# Altium schematic sheet NOX_V3.SchDoc
size 896 x 424 mm
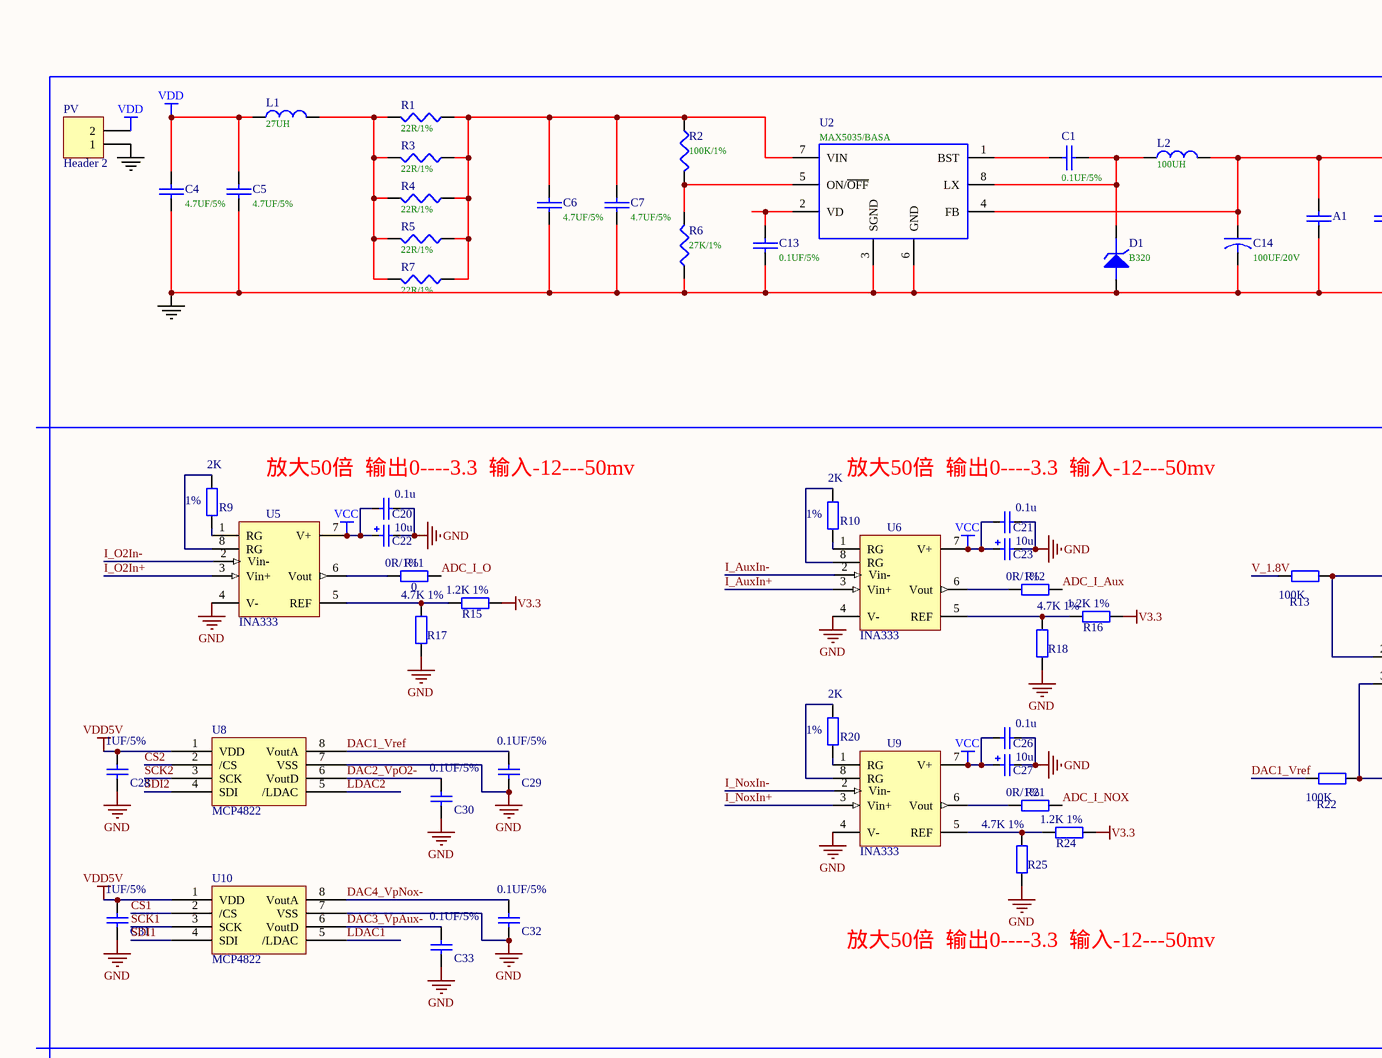
[diagram p0: NOX_V3.SchDoc, top left]
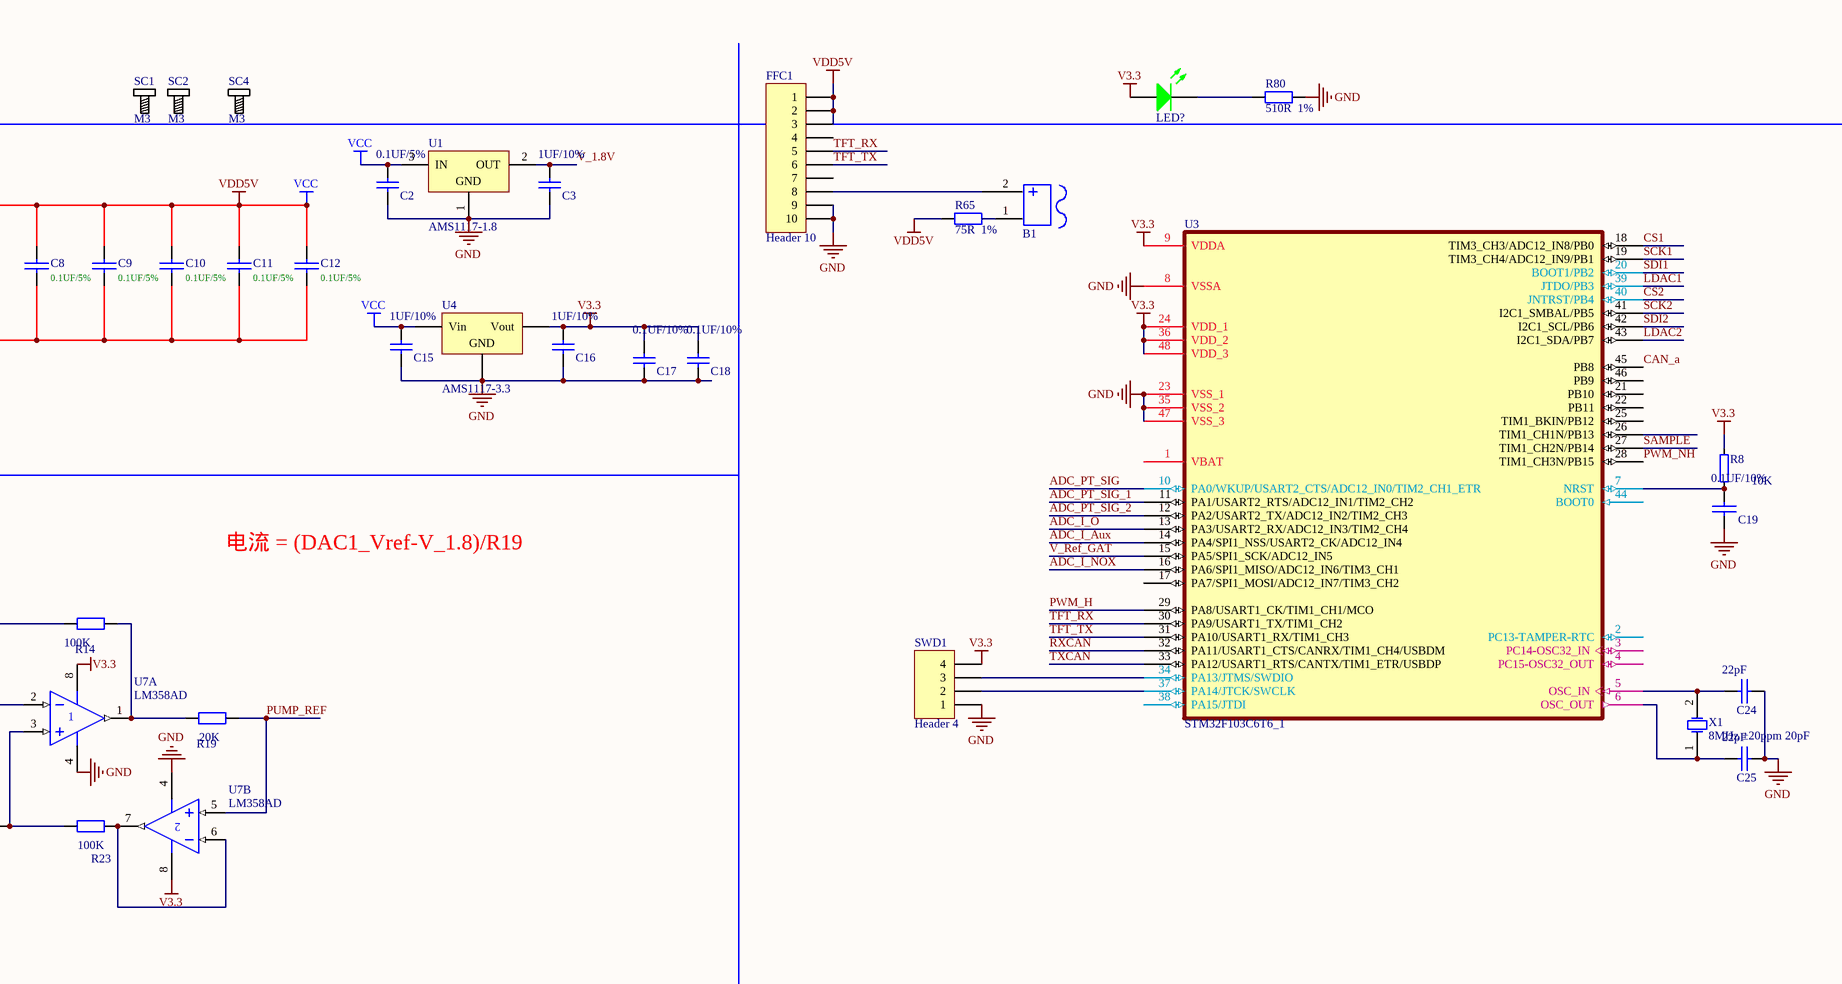
[diagram p1: NOX_V3.SchDoc, top middle]
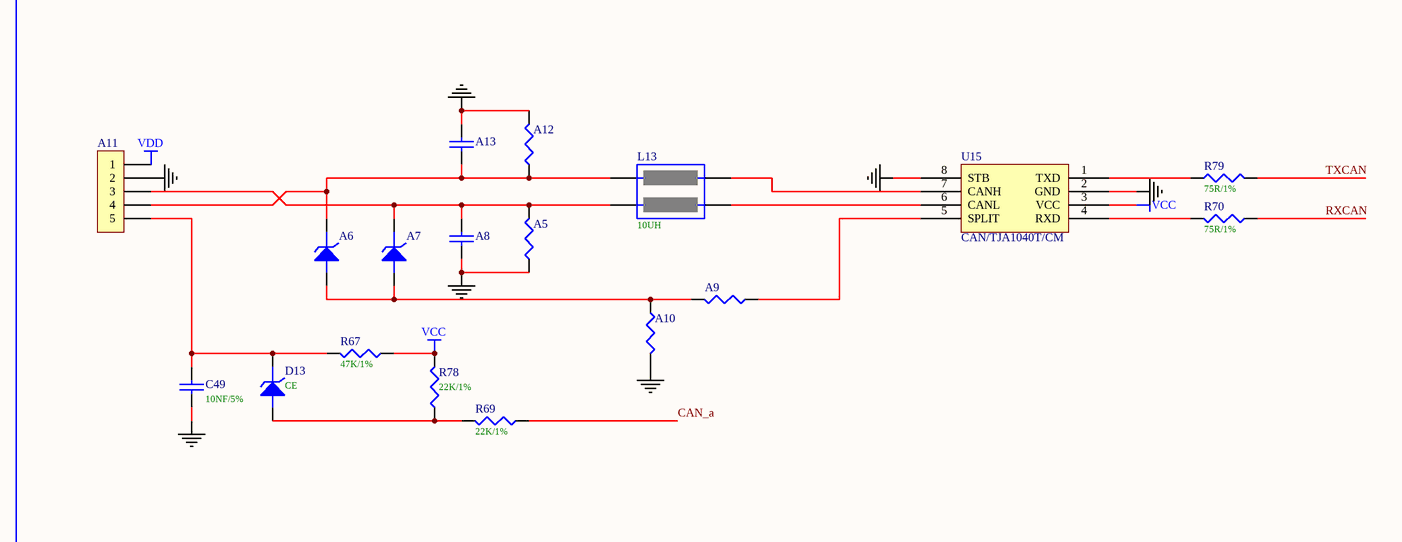
[diagram p2: NOX_V3.SchDoc, top right]
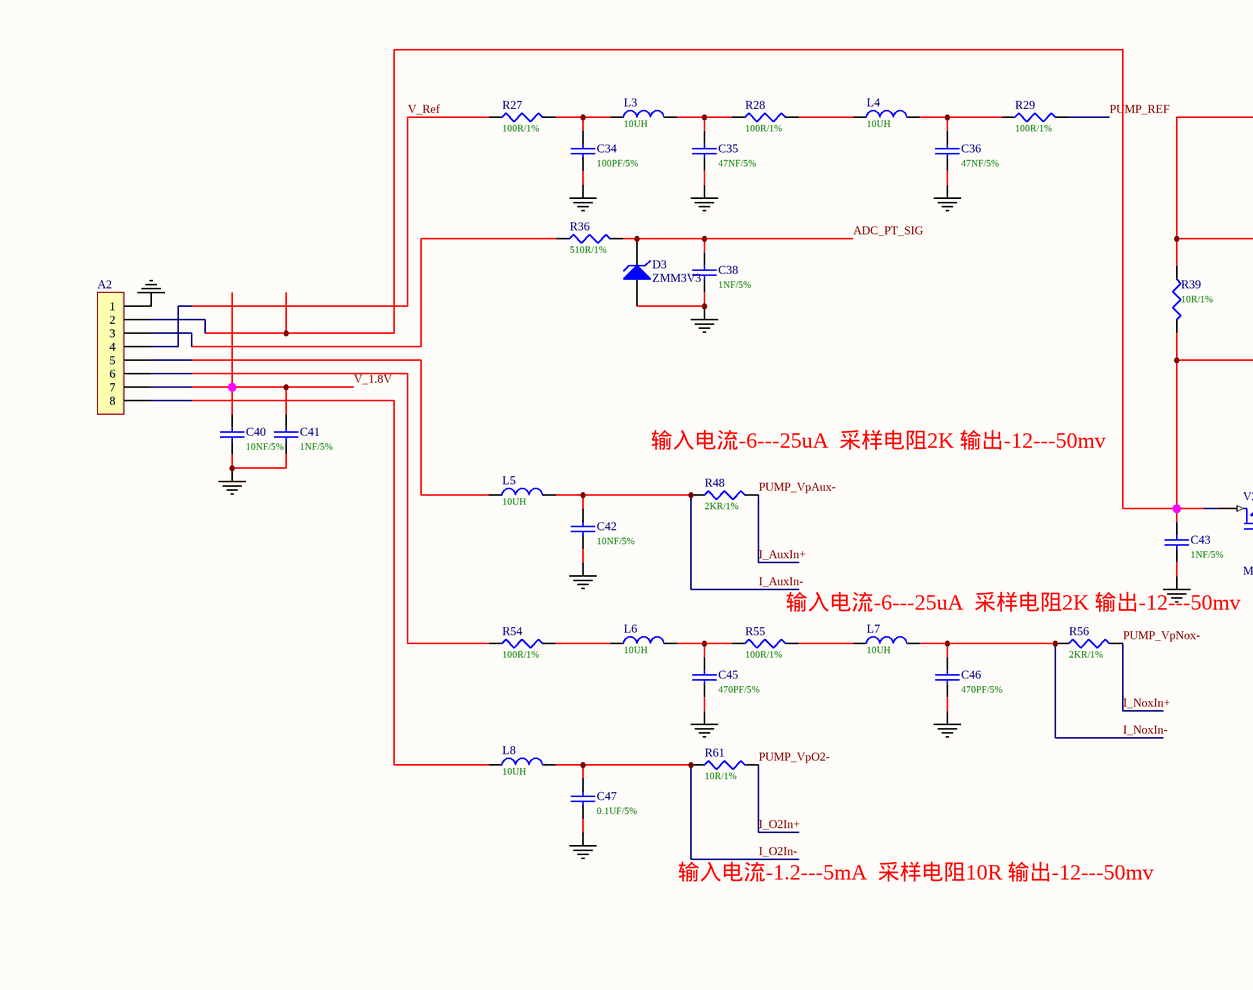
[diagram p3: NOX_V3.SchDoc, bottom left]
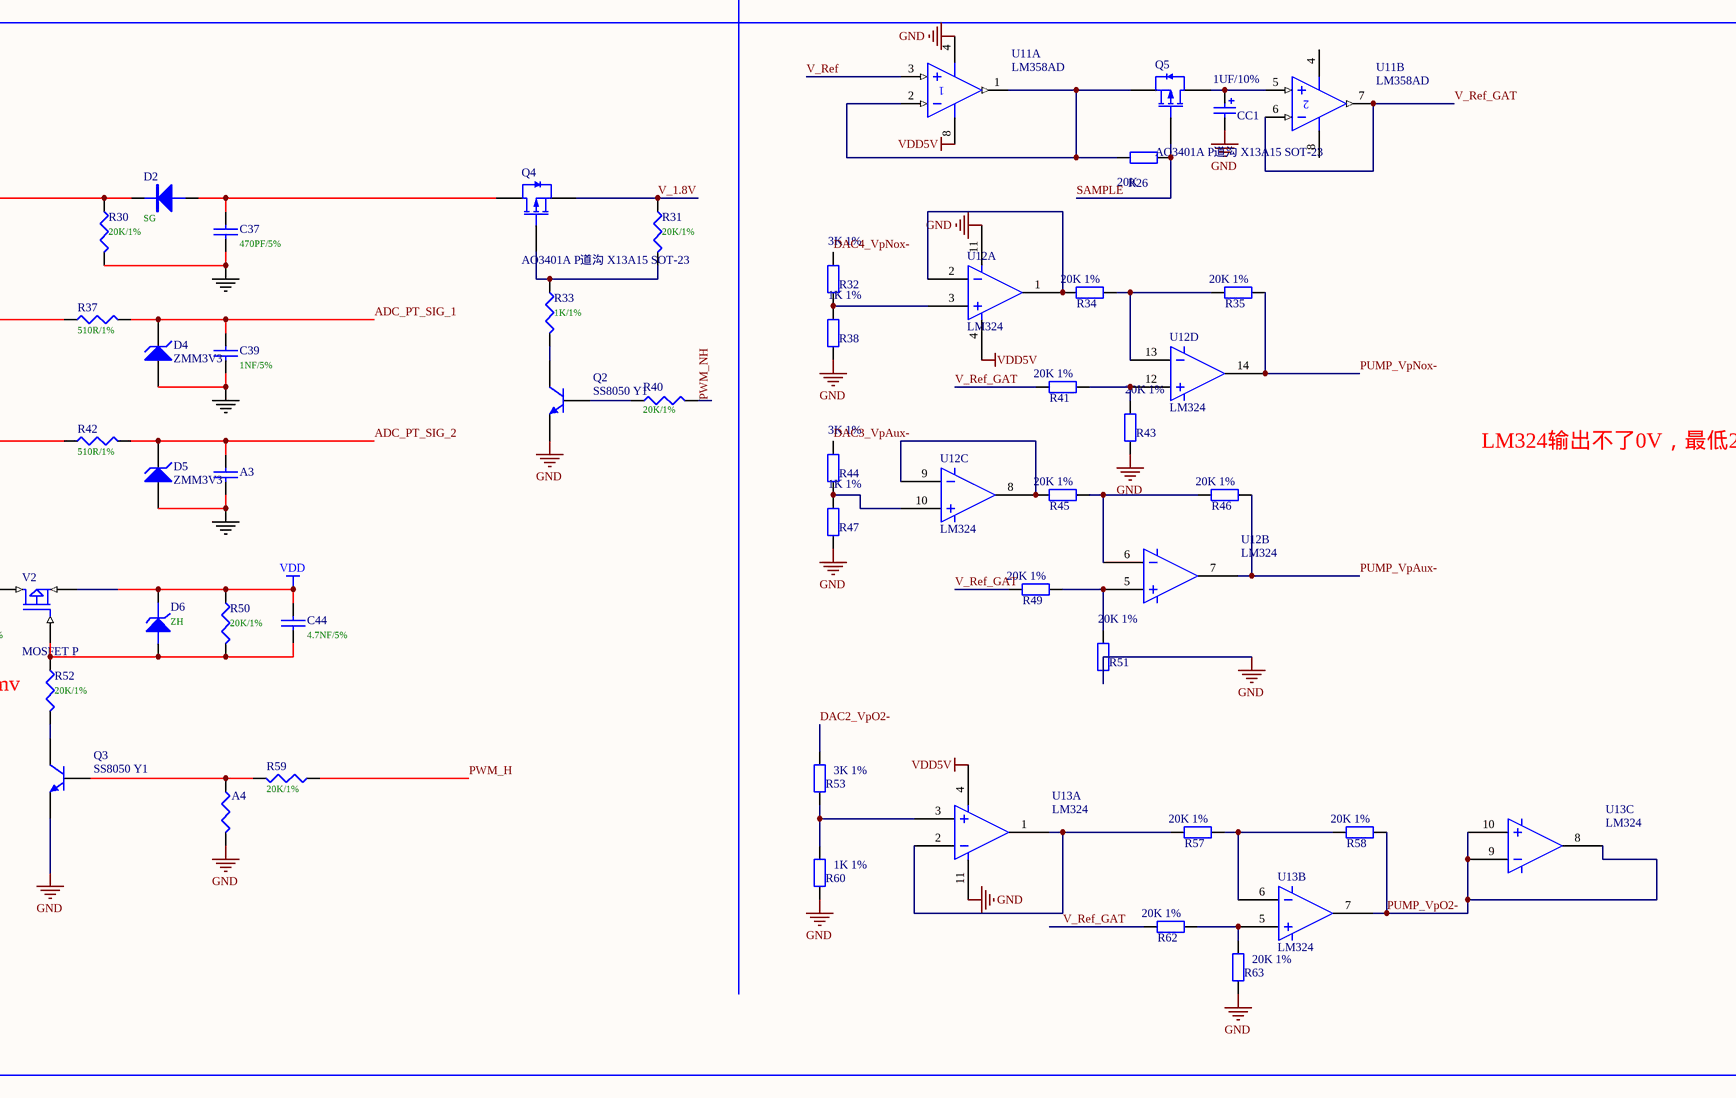
[diagram p4: NOX_V3.SchDoc, bottom middle]

## Parts
A1  (no value)  [1206]
A2  (no value)  [HX3.96-8]
A3  (no value)  [1608[0603]]
A4  (no value)  [1608[0603]]
A5  (no value)  [0603]
A6  (no value)  [1206]
A7  (no value)  [1206]
A8  (no value)  [0603_C]
A9  (no value)  [0603]
A10  (no value)  [0603]
A11  (no value)  [HX3.96-5]
A12  (no value)  [0603]
A13  (no value)  [0603_C]
B1  Buzzer  [BUZZER]  (value not drawn)
C1  0.1UF/5%  [0603_C]
C2  0.1UF/5%  [0603_C]
C3  1UF/10%  [0603_C]
C4  4.7UF/5%  [1210]
C5  4.7UF/5%  [1210]
C6  4.7UF/5%  [1210]
C7  4.7UF/5%  [1210]
C8  0.1UF/5%  [0603_C]
C9  0.1UF/5%  [0603_C]
C10  0.1UF/5%  [0603_C]
C11  0.1UF/5%  [0603_C]
C12  0.1UF/5%  [0603_C]
C13  0.1UF/5%  [0603_C]
C14  100UF/20V  [CAP_ELEC_6.3x4.2]
C15  1UF/10%  [0603_C]
C16  1UF/10%  [0603_C]
C17  0.1UF/10%  [0603_C]
C18  0.1UF/10%  [0603_C]
C19  0.1UF/10%  [0603_C]
C20  0.1u  [0603_C]
C21  0.1u  [0603_C]
C22  10u  [0805_C]
C23  10u  [0805_C]
C24  22pF  [0603_C]
C25  22pF  [0603_C]
C26  0.1u  [0603_C]
C27  10u  [0805_C]
C28  1UF/5%  [0603_C]
C29  0.1UF/5%  [0603_C]
C30  0.1UF/5%  [0603_C]
C31  1UF/5%  [0603_C]
C32  0.1UF/5%  [0603_C]
C33  0.1UF/5%  [0603_C]
C34  100PF/5%  [0603_C]
C35  47NF/5%  [0603_C]
C36  47NF/5%  [0603_C]
C37  470PF/5%  [0603_C]
C38  1NF/5%  [0603_C]
C39  1NF/5%  [0603_C]
C40  10NF/5%  [0603_C]
C41  1NF/5%  [0805_C]
C42  10NF/5%  [0603_C]
C43  1NF/5%  [0603_C]
C44  4.7NF/5%  [0603_C]
C45  470PF/5%  [0603_C]
C46  470PF/5%  [0603_C]
C47  0.1UF/5%  [0603_C]
C49  10NF/5%  [0603_C]
CC1  1UF/10%  [TAN-A-3216]
D1  B320  [SMB]
D2  SG  [SMA]
D3  ZMM3V3  [LL-34]
D4  ZMM3V3  [LL-34]
D5  ZMM3V3  [LL-34]
D6  ZH  [SOD123]
D13  CE  [SOD123]
FFC1  Header 10  [FCC1.0-10]
L1  27UH  [SLF7032]
L2  100UH  [SLF7032]
L3  10UH  [0603_L]
L4  10UH  [0603_L]
L5  10UH  [0603_L]
L6  10UH  [0603_L]
L7  10UH  [0603_L]
L8  10UH  [0603_L]
L13  10UH  [1812-4]
LED?  LED-3-G  [LED-R3-H5-SINGLE-G]  (value not drawn)
PV  Header 2  [HX5.08-2L]
Q2  SS8050 Y1  [SOT-23(SOT-23-3)]
Q3  SS8050 Y1  [SOT-23(SOT-23-3)]
Q4  AO3401A P道沟 X13A15 SOT-23  [SOT-23-3L]
Q5  AO3401A P道沟 X13A15 SOT-23  [SOT-23-3L]
R1  22R/1%  [1206_R]
R2  100K/1%  [0603_R]
R3  22R/1%  [1206_R]
R4  22R/1%  [1206_R]
R5  22R/1%  [1206_R]
R6  27K/1%  [0603_R]
R7  22R/1%  [1206_R]
R8  10K  [0603_R]
R9  2K  精度: 1%  [0603_R]
R10  2K  精度: 1%  [0603_R]
R11  0R/1%  value 0  [0603_R]
R12  0R/1%  [0603_R]
R13  100K  [0603_R]
R14  100K  [0603_R]
R15  1.2K 1%  [0603_R]
R16  1.2K 1%  [0603_R]
R17  4.7K 1%  [0603_R]
R18  4.7K 1%  [0603_R]
R19  20K  [0603_R]
R20  2K  精度: 1%  [0603_R]
R21  0R/1%  [0603_R]
R22  100K  [0603_R]
R23  100K  [0603_R]
R24  1.2K 1%  [0603_R]
R25  4.7K 1%  [0603_R]
R26  20K  [0603_R]
R27  100R/1%  [0603_R]
R28  100R/1%  [0603_R]
R29  100R/1%  [0603_R]
R30  20K/1%  [0603_R]
R31  20K/1%  [0603_R]
R32  3K 1%  [0603_R]
R33  1K/1%  [0603_R]
R34  20K 1%  [0603_R]
R35  20K 1%  [0603_R]
R36  510R/1%  [0805_R]
R37  510R/1%  [0805_R]
R38  1K 1%  [0603_R]
R39  10R/1%  [1206_R]
R40  20K/1%  [0603_R]
R41  20K 1%  [0603_R]
R42  510R/1%  [0805_R]
R43  20K 1%  [0603_R]
R44  3K 1%  [0603_R]
R45  20K 1%  [0603_R]
R46  20K 1%  [0603_R]
R47  1K 1%  [0603_R]
R48  2KR/1%  [0603_R]
R49  20K 1%  [0603_R]
R50  20K/1%  [0603_R]
R51  20K 1%  [0603_R]
R52  20K/1%  [0603_R]
R53  3K 1%  [0603_R]
R54  100R/1%  [0603_R]
R55  100R/1%  [0603_R]
R56  2KR/1%  [0603_R]
R57  20K 1%  [0603_R]
R58  20K 1%  [0603_R]
R59  20K/1%  [0603_R]
R60  1K 1%  [0603_R]
R61  10R/1%  [0603_R]
R62  20K 1%  [0603_R]
R63  20K 1%  [0603_R]
R65  75R  1%  [0603_R]
R67  47K/1%  [0603_R]
R69  22K/1%  [0603_R]
R70  75R/1%  [0603_R]
R78  22K/1%  [0603_R]
R79  75R/1%  [0603_R]
R80  510R  1%  [0603_R]
SC1  M3  [SCRREW_M3]
SC2  M3  [SCRREW_M3]
SC4  M3  [SCRREW_M3]
SWD1  Header 4  [HDR1X4]
U1  AMS1117-1.8  [SOT-223]
U2  MAX5035/BASA  [SO8]
U3  STM32F103C6T6_1  [LQFP-48]
U4  AMS1117-3.3  [SOT-223]
U5  INA333  [TSSOP_8]
U6  INA333  [TSSOP_8]
U7  LM358AD  [SOP-8M]  (parts A,B of 2)
U8  MCP4822  [SO8_M]
U9  INA333  [TSSOP_8]
U10  MCP4822  [SO8_M]
U11  LM358AD  [SOP-8M]  (parts A,B of 2)
U12  LM324  [SOP-14M]  (parts A,B,C,D of 4)
U13  LM324  [SOP-14M]  (parts A,B,C of 4)
U15  CAN/TJA1040T/CM  [SOIC-8_150mil]
V2  MOSFET P  [TO-252]
X1  8MHz ±20ppm 20pF  [SMD-5032_2P]

## Nets
GND: A1.1 A2.1 A3.1 A4.1 A5.1 A8.1 A10.2 A11.2 A12.1 A13.1 C2.1 C3.1 C4.2 C5.2 C6.2 C7.2 C8.1 C9.1 C10.1 C11.2 C12.2 C13.2 C14.2 C15.1 C16.1 C17.1 C18.1 C19.1 C20.1 C21.1 C22.2 C23.2 C24.2 C25.2 C26.1 C27.2 C28.1 C29.1 C30.1 C31.1 C32.1 C33.1 C34.1 C35.1 C36.1 C37.1 C38.2 C39.2 C40.1 C41.1 C42.1 C43.1 C45.2 C46.1 C47.1 C49.2 CC1.1 D1.1(A) D3.1(A) D4.1(A) D5.1(A) FFC1.9 FFC1.10 PV.1 Q2.2(E) Q3.2(E) R6.1 R17.1 R18.1 R25.1 R30.1 R38.1 R43.1 R47.1 R51.1 R60.1 R63.1 R80.2 SWD1.1 U1.1(GND) U2.3(SGND) U2.6(GND) U3.8(VSSA) U3.23(VSS_1) U3.35(VSS_2) U3.47(VSS_3) U4.1(GND) U5.4(V-) U6.4(V-) U7.4(V-) U8.7(VSS) U9.4(V-) U10.7(VSS) U11.4(V-) U12.11 U13.11 U15.2(GND) U15.8(STB)
V3.3: C16.2 C17.2 C18.2 LED?.1(A) R8.2 R15.1 R16.1 R24.1 SWD1.4 U3.9(VDDA) U3.24(VDD_1) U3.36(VDD_2) U3.48(VDD_3) U4.2(Vout) U7.8(V+)
VCC: A1.2 C2.2 C8.2 C9.2 C10.2 C11.1 C12.1 C14.1 C15.2 C20.2 C21.2 C22.1 C23.1 C26.2 C27.1 C28.2 C31.2 FFC1.1 FFC1.2 FFC1.3 L2.1 R65.1 R67.1 R78.2 U1.3(IN) U2.4(FB) U4.3(Vin) U5.7(V+) U6.7(V+) U8.1(VDD) U9.7(V+) U10.1(VDD) U11.8(V+) U12.4 U13.4 U15.3(VCC)  [also labelled VDD5V]
VDD: A11.1 C4.1 C5.1 C44.1 D6.2(K) L1.2 PV.2 R50.2 V2.3(S)
ADC_I_Aux: R12.1 U3.14(PA4/SPI1_NSS/USART2_CK/ADC12_IN4)
ADC_I_NOX: R21.1 U3.16(PA6/SPI1_MISO/ADC12_IN6/TIM3_CH1)
ADC_I_O: R11.1 U3.13(PA3/USART2_RX/ADC12_IN3/TIM2_CH4)
ADC_PT_SIG: C38.1 D3.2(K) R36.1 U3.10(PA0/WKUP/USART2_CTS/ADC12_IN0/TIM2_CH1_ETR)
ADC_PT_SIG_1: C39.1 D4.2(K) R37.2 U3.11(PA1/USART2_RTS/ADC12_IN1/TIM2_CH2)
ADC_PT_SIG_2: A3.2 D5.2(K) R42.1 U3.12(PA2/USART2_TX/ADC12_IN2/TIM2_CH3)
CAN_a: R69.1 U3.45(PB8)
CS1: U3.18(TIM3_CH3/ADC12_IN8/PB0) U10.2(/CS)
CS2: U3.40(JNTRST/PB4) U8.2(/CS)
DAC1_Vref: C29.2 R22.1 U8.8(VoutA)
DAC2_VpO2-: C30.2 R53.2 U8.6(VoutD)
DAC3_VpAux-: C33.2 R44.2 U10.6(VoutD)
DAC4_VpNox-: C32.2 R32.2 U10.8(VoutA)
I_AuxIn+: R46.1 R48.2 U6.3(Vin+) U12.7  [also labelled PUMP_VpAux-]
I_AuxIn-: C42.2 L5.1 R48.1 U6.2(Vin-)
I_NoxIn+: R35.1 R56.2 U9.3(Vin+) U12.14  [also labelled PUMP_VpNox-]
I_NoxIn-: C46.2 L7.1 R56.1 U9.2(Vin-)
I_O2In+: R58.1 R61.2 U5.3(Vin+) U13.7 U13.8 U13.9 U13.10  [also labelled PUMP_VpO2-]
I_O2In-: C47.2 L8.2 R61.1 U5.2(Vin-)
LDAC1: U3.39(JTDO/PB3) U10.5(/LDAC)
LDAC2: U3.43(I2C1_SDA/PB7) U8.5(/LDAC)
PUMP_REF: R19.2 R29.2 U7.5(IN+)
PWM_H: R59.1 U3.29(PA8/USART1_CK/TIM1_CH1/MCO)
PWM_NH: R40.1 U3.28(TIM1_CH3N/PB15)
RXCAN: R70.2 U3.32(PA11/USART1_CTS/CANRX/TIM1_CH4/USBDM)
SAMPLE: Q5.1(G) R26.2 U3.27(TIM1_CH2N/PB14)
SCK1: U3.19(TIM3_CH4/ADC12_IN9/PB1) U10.3(SCK)
SCK2: U3.41(I2C1_SMBAL/PB5) U8.3(SCK)
SDI1: U3.20(BOOT1/PB2) U10.4(SDI)
SDI2: U3.42(I2C1_SCL/PB6) U8.4(SDI)
TFT_RX: FFC1.5 U3.30(PA9/USART1_TX/TIM1_CH2)
TFT_TX: FFC1.6 U3.31(PA10/USART1_RX/TIM1_CH3)
TXCAN: R79.1 U3.33(PA12/USART1_RTS/CANTX/TIM1_ETR/USBDP)
V_1.8V: A2.7 C3.2 C40.2 C41.2 Q4.2(S) R13.1 R31.2 U1.2(OUT)
V_Ref: A2.4 R27.2 U11.3(IN+)
V_Ref_GAT: R41.2 R49.2 R62.2 U3.15(PA5/SPI1_SCK/ADC12_IN5) U11.6(IN-) U11.7(OUT)
NetA2_2: A2.2 C43.2 R39.1 R42.2 V2.2(D)
NetA2_3: A2.3 R36.2
NetA2_5: A2.5 L5.2
NetA2_6: A2.6 R54.1
NetA2_8: A2.8 L8.1
NetA4_2: A4.2 Q3.1(B) R59.2
NetA5_2: A5.2 A7.2(K) A8.2 A11.3 L13.4
NetA6_1: A6.1(A) A7.1(A) A9.1 A10.1
NetA6_2: A6.2(K) A11.4 A12.2 A13.2 L13.3
NetA9_2: A9.2 U15.5(SPLIT)
NetA11_5: A11.5 C49.1 D13.2(K) R67.2
NetB1_1: B1.1 R65.2
NetB1_2: B1.2 FFC1.8
NetC1_1: C1.1 D1.2(K) L2.2 U2.8(LX)
NetC1_2: C1.2 U2.1(BST)
NetC6_1: C6.1 C7.1 R1.1 R2.1 R3.1 R4.1 R5.2 R7.2 U2.7(VIN)
NetC13_1: C13.1 U2.2(VD)
NetC19_2: C19.2 R8.1 U3.7(NRST)
NetC24_1: C24.1 U3.5(OSC_IN) X1.2(OSC2)
NetC25_1: C25.1 U3.6(OSC_OUT) X1.1(OSC1)
NetC34_2: C34.2 L3.1 R27.1
NetC35_2: C35.2 L3.2 R28.1
NetC36_2: C36.2 L4.1 R29.1
NetC37_2: C37.2 D2.1(A) Q4.3(D)
NetC44_2: C44.2 D6.1(A) R50.1 R52.2 V2.1(G)
NetC45_1: C45.1 L6.1 R55.1
NetCC1_2: CC1.2 Q5.3(D) U11.5(IN+)
NetD2_2: D2.2(K) R30.2 R37.1 R39.2
NetD13_1: D13.1(A) R69.2 R78.1
NetL1_1: L1.1 R1.2 R3.2 R4.2 R5.1 R7.1
NetL4_2: L4.2 R28.2
NetL6_2: L6.2 R54.2
NetL7_2: L7.2 R55.2
NetL13_1: L13.1 U15.6(CANL)
NetL13_2: L13.2 U15.7(CANH)
NetLED?_2: LED?.2(K) R80.1
NetQ2_1: Q2.1(B) R40.2
NetQ2_3: Q2.3(C) R33.1
NetQ3_3: Q3.3(C) R52.1
NetQ4_1: Q4.1(G) R31.1 R33.2
NetQ5_2: Q5.2(S) R26.1 U11.1(OUT) U11.2(IN-)
NetR2_2: R2.2 R6.2 U2.5(ON/~{OFF})
NetR9_1: R9.1 U5.1(RG)
NetR9_2: R9.2 U5.8(RG)
NetR10_1: R10.1 U6.1(RG)
NetR10_2: R10.2 U6.8(RG)
NetR11_2: R11.2 U5.6(Vout)
NetR12_2: R12.2 U6.6(Vout)
NetR13_2: R13.2 R14.1 U7.2(IN-)
NetR14_2: R14.2 R19.1 U7.1(OUT)
NetR15_2: R15.2 R17.2 U5.5(REF)
NetR16_2: R16.2 R18.2 U6.5(REF)
NetR20_1: R20.1 U9.1(RG)
NetR20_2: R20.2 U9.8(RG)
NetR21_2: R21.2 U9.6(Vout)
NetR22_2: R22.2 R23.1 U7.3(IN+)
NetR23_2: R23.2 U7.6(IN-) U7.7(OUT)
NetR24_2: R24.2 R25.2 U9.5(REF)
NetR32_1: R32.1 R38.2 U12.3
NetR34_1: R34.1 R35.2 U12.13
NetR34_2: R34.2 U12.1 U12.2
NetR41_1: R41.1 R43.2 U12.12
NetR44_1: R44.1 R47.2 U12.10
NetR45_1: R45.1 R46.2 U12.6
NetR45_2: R45.2 U12.8 U12.9
NetR49_1: R49.1 R51.2 U12.5
NetR53_1: R53.1 R60.2 U13.3
NetR57_1: R57.1 R58.2 U13.6
NetR57_2: R57.2 U13.1 U13.2
NetR62_1: R62.1 R63.2 U13.5
NetR70_1: R70.1 U15.4(RXD)
NetR79_2: R79.2 U15.1(TXD)
NetSWD1_2: SWD1.2 U3.37(PA14/JTCK/SWCLK)
NetSWD1_3: SWD1.3 U3.34(PA13/JTMS/SWDIO)

Not connected (* = marked no-connect by the designer): FFC1 4 7; U3 1(VBAT) 2(PC13-TAMPER-RTC) 3(PC14-OSC32_IN) 4(PC15-OSC32_OUT) 17(PA7/SPI1_MOSI/ADC12_IN7/TIM3_CH2) 21(PB10) 22(PB11) 25(TIM1_BKIN/PB12) 26(TIM1_CH1N/PB13) 38(PA15/JTDI) 44(BOOT0) 46(PB9)

## Notes on the sheet
- (near C20) 放大50倍  输出0----3.3  输入-12---50mv
- 放大50倍  输出0----3.3  输入-12---50mv
- 电流 = (DAC1_Vref-V_1.8)/R19
- LM324输出不了0V，最低200mv
- (near R48) 输入电流-6---25uA  采样电阻2K 输出-12---50mv
- 输入电流-6---25uA  采样电阻2K 输出-12---50mv
- 输入电流-1.2---5mA  采样电阻10R 输出-12---50mv

## Library data of the parts
A1 A3 A8 A13 C1 C4-C13 C34-C47 C49 = CAP: Capacitor
A2 = CON8: Connector
A4 A5 A9 A10 A12 R1-R7 R27-R31 R33 R36 R37 R39 R40 R42 R48 R50 R52 R54-R56 R59 R61 R67 R69 R70 R78 R79 = RES1
A6 A7 D1 D6 D13 = ZENER3: Zener Diode
A11 = CON5: Connector
C2 C3 C15-C18 C28-C33 = Cap Chip: Polarized Capacitor (Radial); Value: 104; Published: 8-Jun-2000; Revision: July-2002: Re-released for DXP Platform.; Publisher: Altium Limited
C14 = CAPACITOR
C19 C24 C25 = CAP
C20 C21 C26 = Cap: Capacitor; Value: 0.1uF; Published: 8-Jun-2000; LatestRevisionDate: 17-Jul-2002; LatestRevisionNote: Re-released for DXP Platform.; Publisher: Altium Limited
C22 C23 C27 = Cap Pol1: Polarized Capacitor (Radial); Value: 100pF; Published: 8-Jun-2000; LatestRevisionDate: 17-Jul-2002; LatestRevisionNote: Re-released for DXP Platform.; Publisher: Altium Limited
CC1 = Cap Tan: Polarized Capacitor (Radial); Value: 104; Voltage: 16V; Published: 8-Jun-2000; Revision: July-2002: Re-released for DXP Platform.; Publisher: Altium Limited
D2 = DIODE
D3-D5 = LL-34 ZMM3V3: 稳压二极管; ComponentLink1Description: 供应商链接; ComponentLink1URL: http://www.szlcsc.com/product/details_8535.html; Package: LL-34; Supplier: LC; SuppliersPartNumber: C8056
FFC1 = Header 10: Header, 10-Pin; LatestRevisionDate: 17-Jul-2002; LatestRevisionNote: Re-released for DXP Platform.; Publisher: Altium Limited
L1-L8 = INDUCTOR
L13 = TRANS3_1
LED? = LED-3-G: Typical INFRARED GaAs LED; Published: 8-Jun-2000; Revision: July-2002: Re-released for DXP Platform.; Publisher: Altium Limited
PV = Header 2: Header, 2-Pin; LatestRevisionDate: 17-Jul-2002; LatestRevisionNote: Re-released for DXP Platform.; Publisher: Altium Limited
Q2 Q3 = SOT-23 SS8050 Y1: 三极管; ComponentLink1Description: 供应商链接; ComponentLink1URL: http://www.szlcsc.com/product/details_2507.html; Package: SOT-23; Supplier: LC; SuppliersPartNumber: C2150
Q4 Q5 = AO3401A P道沟 X13A15 SOT-23: MOS(场效应管); ComponentLink1Description: 供应商链接; ComponentLink1URL: http://www.szlcsc.com/product/details_15801.html; Package: SOT-23; Supplier: LC; SuppliersPartNumber: C15127
R8 = RES
R9-R11 R20 = Res2: Resistor; Published: 8-Jun-2000; LatestRevisionDate: 17-Jul-2002; LatestRevisionNote: Re-released for DXP Platform.; Publisher: Altium Limited
R12 R21 = Res2: Resistor; Value: 0; Published: 8-Jun-2000; LatestRevisionDate: 17-Jul-2002; LatestRevisionNote: Re-released for DXP Platform.; Publisher: Altium Limited
R13-R19 R22-R26 R32 R34 R35 R38 R41 R43-R47 R49 R51 R53 R57 R58 R60 R62 R63 = Resistor Chip: Resistor; Published: 8-Jun-2000; Revision: July-2002: Re-released for DXP Platform.; Publisher: Altium Limited
R65 = 0603 6.2KΩ (6201) 1%: 贴片电阻; ComponentLink1Description: 供应商链接; ComponentLink1URL: http://www.szlcsc.com/product/details_4667.html; Package: 0603; Supplier: LC; SuppliersPartNumber: C4260
R80 = 0603 1.5KΩ (1501) 1%: 贴片电阻; ComponentLink1Description: 供应商链接; ComponentLink1URL: http://www.szlcsc.com/product/details_23570.html; Package: 0603; Supplier: LC; SuppliersPartNumber: C22843
SC1 SC2 SC4 = Screw_M3: Screw
SWD1 = Header 4: Header, 4-Pin; LatestRevisionDate: 17-Jul-2002; LatestRevisionNote: Re-released for DXP Platform.; Publisher: Altium Limited
U1 = AMS1117: POSITIVE OUTPUT VOLTAGE
U2 = MAX5035
U3 = STM32F103C6T6_1: STM32 ARM-based 32-bit MCU with 32 Kbytes Flash, 48-pin LQFP, Industrial Temperature; Published: *; DatasheetVersion: *; PackageVersion: *; PackageReference: *; Publisher: *; PackageDescription: *; ComponentLink1Description: *; ComponentLink1URL: *; ComponentLink2Description: *; ComponentLink2URL: *
U4 = SOT-223 AMS1117-3.3: 低压差线性稳压(LDO); ComponentLink1Description: 供应商链接; ComponentLink1URL: http://www.szlcsc.com/product/details_6652.html; Package: SOT-223; Supplier: LC; SuppliersPartNumber: C6186
U7 U11 = LM358AD: Dual Operational Amplifier; Published: 15-Apr-2002; LatestRevisionDate: 4-Mar-2005; LatestRevisionNote: Stylized 3D Model Added.; DatasheetDocument: Aug-1988; PackageDocument: Jan-1998; PackageReference: D008; Publisher: Altium Limited; ComponentLink1Description: Manufacturer Link; ComponentLink1URL: http://www.ti.com/
U15 = CAN/TJA1040T/CM: CAN; ComponentLink1Description: 供应商链接; ComponentLink1URL: http://www.szlcsc.com/product/details_7423.html; Package: SOIC-8_150mil; Supplier: LC; SuppliersPartNumber: C6951
X1 = SMD-5032_2P 8MHz 20ppm 20pF: 贴片晶振; ComponentLink1Description: 供应商链接; ComponentLink1URL: http://www.szlcsc.com/product/details_19261.html; Package: SMD-5032_2P; Supplier: LC; SuppliersPartNumber: C18560